# EAGLE design os32_master (EAGLE 9.3.0)
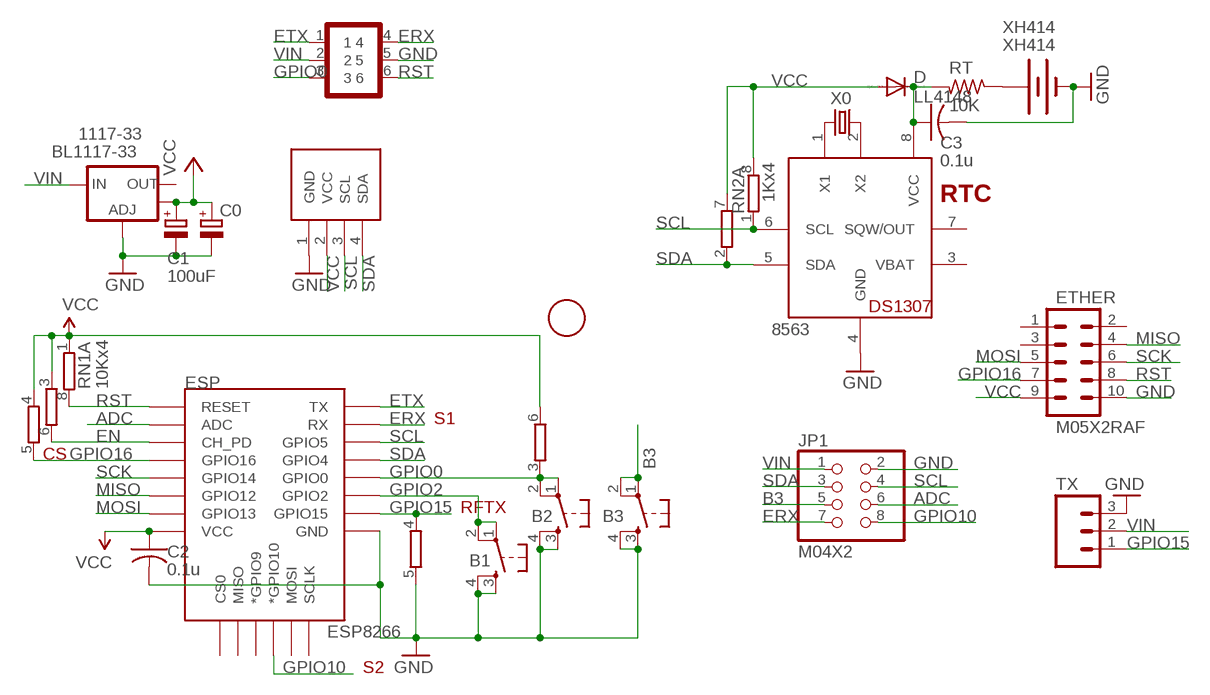
[diagram p0: schematic, sheet 1]

## Parts
1F  FIDUCIAL  [FIDUCIAL_1MM]
1117-33  BL1117-33  V_REG_LM1117SOT223  [SOT223]
8563  PCF8563  DS1307SOIC  [SO08]
B1  SPST_TACTEVQQ2  [EVQ-Q2]
B2  SPST_TACTEVQQ2  [EVQ-Q2]
B3  SPST_TACTEVQQ2  [EVQ-Q2]
C0  CPOL-EUE2.5-5  [E2,5-5]
C1  100uF  CPOL-EUCT3528  [CT3528]
C2  0.1u  C-USC0603  [C0603]
C3  0.1u  C-USC0603  [C0603]
D  LL4148  DIODE-MINIMELF  [MINIMELF]
ESP  ESP8266  ESP12ESMD  [ESP12E-SMD]
ETHER  M05X2RAF  [2X5-RAF]
JP1  M04X2  PINHD-2X4  [2X04]
LCD  SSD1306_OLED_I2CSMD3  [SSD1306_OLED_I2C_SMD3]
RN1  10Kx4  4R-NEXB38V  [EXB38V]
RN2  1Kx4  4R-NEXB38V  [EXB38V]
RT  10K  R-US_R0603  [R0603]
TX  M03LOCK  [1X03_LOCK]
U$3  GOLDFINGER_2X3  [GOLDFINGER_2X3]
X0  32.768kHz  CRYSTALMM20SS1  [MM20SS1]
XH414  XH414  BATTERYXH414  [BATTCON_XH414]

## Nets
ADC [adc]: ESP.ADC JP1.6
B3: B3.1 B3.2 JP1.5
EN: ESP.CH_PD RN1.6
ERX: ESP.RXD0(RX) JP1.7 U$3.4
ETX: ESP.TXD0(TX) U$3.1
GND: 1117-33.1(ADJ) 8563.4(GND) B1.3 B1.4 B2.3 B2.4 B3.3 B3.4 C0.- C1.+(-) C2.2 C3.2 ESP.GND ETHER.10 JP1.2 LCD.1(GND) RN2.5 TX.3 U$3.5 XH414.P$1(-)
GPIO0: B2.1 B2.2 ESP.GPIO0 RN2.3 U$3.3
GPIO2: B1.1 B1.2 ESP.GPIO2
GPIO10: ESP.GPIO10(*GPIO10) JP1.8
GPIO15: ESP.GPIO15 RN2.4 TX.1
GPIO16: ESP.GPIO16 ETHER.7 RN1.5
MISO: ESP.GPIO12 ETHER.4
MOSI: ESP.GPIO13 ETHER.5
N$1: 8563.1(X1) X0.1
N$11: 8563.8(VCC) C3.1 D.C RT.2
N$30: 8563.2(X2) X0.4
N$36: RT.1 XH414.P$2(+)
RST: ESP.RESET ETHER.8 RN1.8 U$3.6
SCK: ESP.GPIO14 ETHER.6
SCL [I2C]: 8563.6(SCL) ESP.GPIO5 JP1.4 LCD.3(SCL) RN2.1
SDA [I2C]: 8563.5(SDA) ESP.GPIO4 JP1.3 LCD.4(SDA) RN2.2
VCC [vcc]: 1117-33.4(OUT) C0.+ C1.-(+) C2.1 D.A ESP.VCC ETHER.9 LCD.2(VCC) RN1.1 RN1.3 RN1.4 RN2.6 RN2.7 RN2.8
VIN [power]: 1117-33.3(IN) JP1.1 TX.2 U$3.2
Unconnected: 1117-33.2(OUT) 8563.7(SQW/OUT) ESP.CS0 ESP.GPIO9(*GPIO9) ESP.MISO ESP.MOSI ESP.SCLK ETHER.1 ETHER.2 ETHER.3 RN1.2 RN1.7

## Notes on the sheet
- RTC
- S1
- CS
- RFTX
- S2

## Power pins joined to a net without a drawn wire
VBAT: 8563.3(VBAT)

## Library data of the parts
1F = adafruitGood:FIDUCIAL: For use by pick and place machines to calibrate the vision/machine, 1mm By microbuilder.eu
1117-33 = SparkFun:V_REG_LM1117: Voltage Regulator LM1117 Standard adjustable voltage regulator but in SMD form. Spark Fun Electronics SKU : COM-00595
8563 = adafruit:DS1307: DS1307 Real time clock (RTC) with battery backup ability. Talk to it via i2c
B1-B3 = adafruit_3:SPST_TACT: SMT 6mm switch, EVQQ2 series http://www.ladyada.net/library/eagle
C0 = rcl:CPOL-EU: POLARIZED CAPACITOR, European symbol
C1 = resistor:CPOL-EU: POLARIZED CAPACITOR, European symbol
C2 C3 = adafruit:C-US: CAPACITOR, American symbol
D = diode:DIODE-: DIODE
ESP = esp8266modules:ESP12E: ESP12E Module
ETHER = SparkFunNew:M05X2: Header 5x2 Standard 10-pin dual row 0.1" header. Commonly used with AVR-ISP. Use with Spark Fun Electronics SKU: PRT-00778
JP1 = pinhead:PINHD-2X4: PIN HEADER
LCD = adafruit2013:SSD1306_OLED_I2C
RN1 RN2 = resistor-dil:4R-N: Array Chip Resistor Source: RS Component / Phycomp; OC_FARNELL: unknown; OC_NEWARK: unknown
RT = adafruitGood:R-US_: RESISTOR, American symbol
TX = SparkFun:M03: Header 3 Standard 3-pin 0.1" header. Use with straight break away headers (SKU : PRT-00116), right angle break away headers (PRT-00553), swiss pins (PRT-00743), machine pins (PRT-00117), and female headers (PRT-00115). Molex polarized connector foot print use with SKU : PRT-08232 with associated crimp pins and housings.
U$3 = SparkFunNew:GOLDFINGER_2X3
X0 = crystal:CRYSTAL: CRYSTAL
XH414 = SparkFunNew:BATTERY: Battery Holders Various common sizes : AA, AAA, 20mm coin cell and 12mm coin cell.

## Net classes
0 default: width 0.254 mm, clearance 0.203 mm
1 power: width 0.406 mm, clearance 0.203 mm
2 relaypower: width 0.254 mm, clearance 0.203 mm
3 signal: width 0.254 mm, clearance 0.203 mm
4 adc: width 0.406 mm, clearance 0.203 mm
5 vcc: width 0.305 mm, clearance 0.203 mm
6 I2C: width 0.254 mm, clearance 0.203 mm

## Board
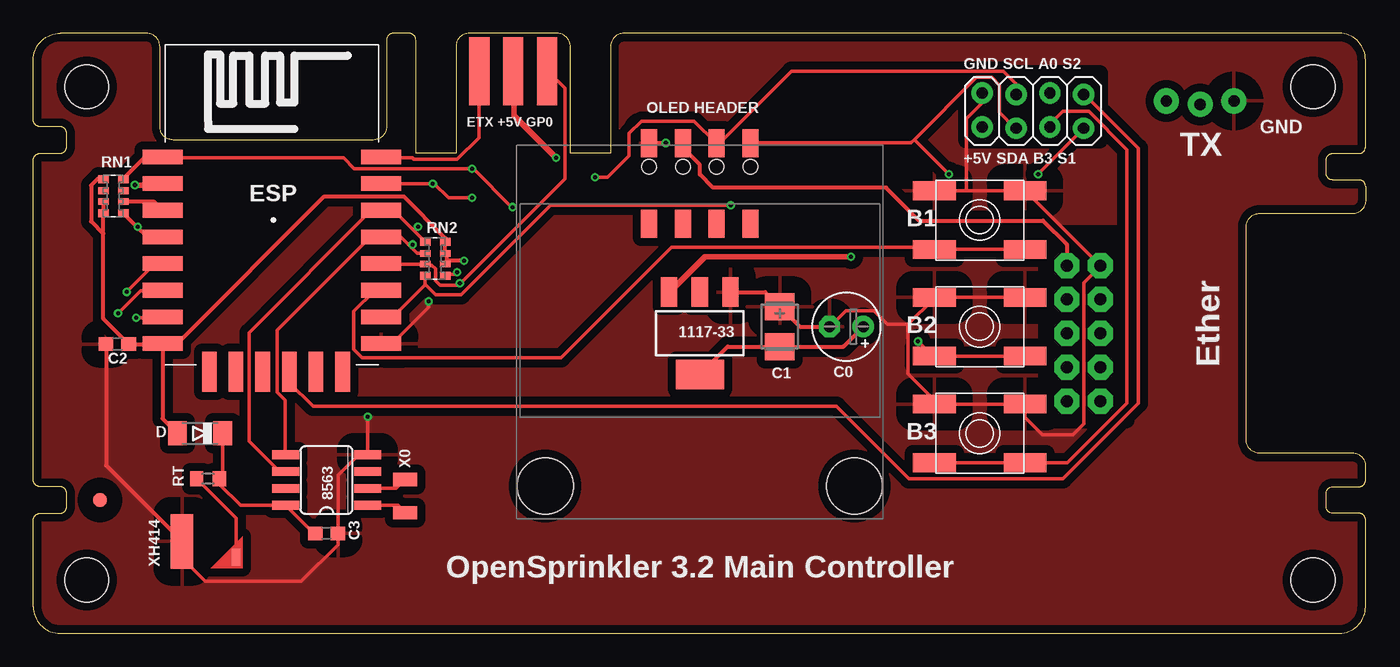
[diagram p1: board, top side]
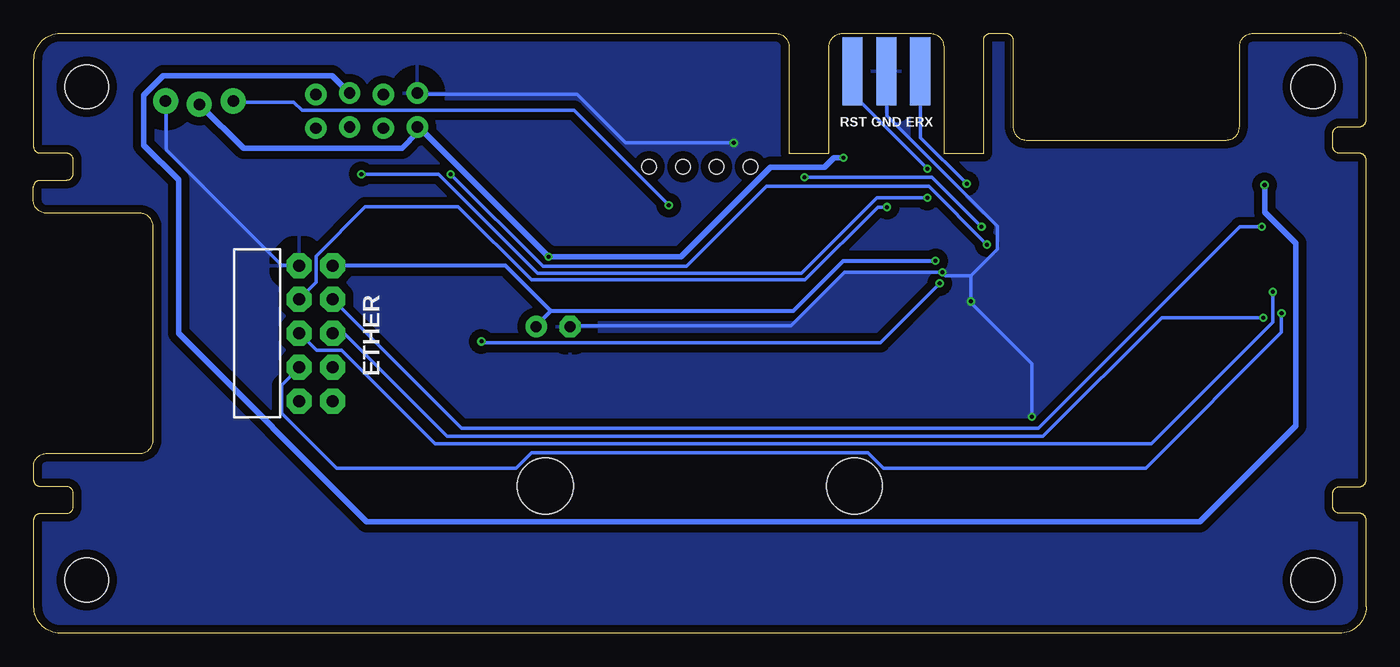
[diagram p2: board, bottom side, seen from below]

Size 100 x 45 mm. Coordinates in mm from the lower left corner, seen from the top.
Outline: 2,0 98,0 arc90 99.95,2 99.95,8.5 arc90 99.5,9 97.5,9 arc-90 97,9.5 97,10.5 arc-90 97.5,11 99.5,11 arc90 99.95,11.5 99.99,12.49 arc91 98.99,13.5 92,13.5 arc-90 91,14.5 91,30.5 arc-90 92,31.5 99,31.5 arc90 100,32.5 100,33.5 99.95,33.5 arc90 99.5,34 97.5,34 arc-90 97,34.5 97,35.5 arc-90 97.5,36 99.5,36 arc90 99.95,36.5 99.95,43 arc90 98,45 44.3,45 arc90 43.3,44 43.3,36 40.3,36 40.3,44 arc90 39.3,45 32.7,45 arc90 31.7,44 31.7,36 28.7,36 28.7,44.5 arc90 28.2,45 27,45 arc90 26.5,44.5 26.5,38 arc-90 25.5,37 10.5,37 arc-90 9.5,38 9.5,44 arc90 8.5,45 2,45 arc90 0,43 0,38.5 arc90 0.5,38 2,38 arc-90 2.5,37.5 2.5,36.5 arc-90 2,36 0.5,36 arc90 0,35.5 0,11.5 arc90 0.5,11 2,11 arc-90 2.5,10.5 2.5,9.5 arc-90 2,9 0.5,9 arc90 0,8.5 0,2 arc90 2,0
Copper layers (1*16): Top 0.035mm / dielectric 1.5mm / Bottom 0.035mm
Design rules "Fusion_eagle_rule_v1.1 *": minimum track width 6mil, minimum drill 12mil, track to track 6mil, track to pad 6mil, pad to pad 6mil, via to via 6mil, smd to smd 0mil, copper to edge 10mil, drill to drill 10mil, minimum pad ring 10mil, minimum via ring 6mil, stop-mask expansion 2mil, vias tented up to drill 100mil, thermal gap 50mil
Holes 3.3 mm at 4,4 96,4 4,41 96,41
tRestrict: area 12.5,6 to 13.5,8; area 70,37 to 80,42; area 76,16 to 82,30; area 13,6 to 15,9.5
vRestrict: area 11,20.5 to 25,36.5; area 31.5,36 to 40.5,45

### Footprints (pad centres in the part's own frame; a part is rotated, then mirrored left to right if it is on the bottom)
FIDUCIAL_1MM = smd 1 x 1: 1 0,0
SOT223 = smd 1.219 x 2.235: 1 -2.311,-3.099; 2 0,-3.099; 3 2.311,-3.099 | smd 3.6 x 2.2: 4 0,3.099
SO08 = smd 0.66 x 2.032: 1 -1.905,-3.073; 2 -0.635,-3.073; 3 0.635,-3.073; 4 1.905,-3.073; 5 1.905,3.073; 6 0.635,3.073; 7 -0.635,3.073; 8 -1.905,3.073
EVQ-Q2 = smd 3.2 x 1.4: 1 -3.4,-2.2; 2 3.4,-2.2; 3 -3.4,2.2; 4 3.4,2.2
E2,5-5 = drill 0.813 pad 1.6: + -1.27,0 | drill 0.813 pad 1.6 octagon: - 1.27,0
CT3528 = smd 2 x 2.2: + -1.5,0; - 1.5,0
C0603 = smd 1.1 x 1: 1 -0.85,0; 2 0.85,0
MINIMELF = smd 1.4 x 1.8: A 1.7,0; C -1.7,0
ESP12E-SMD = smd 3 x 1.1: ADC -8.3,2.73; CH_PD -8.3,0.73; GND 8.1,-9.27; GPIO0 8.1,-3.27; GPIO2 8.1,-5.27; GPIO4 8.1,-1.27; GPIO5 8.1,0.73; GPIO12 -8.3,-5.27; GPIO13 -8.3,-7.27; GPIO14 -8.3,-3.27; GPIO15 8.1,-7.27; GPIO16 -8.3,-1.27; RESET -8.3,4.73; RXD0 8.1,2.73; TXD0 8.1,4.73; VCC -8.3,-9.27 | smd 1.1 x 3: CS0 -4.8,-11.37; GPIO9 -0.8,-11.37; GPIO10 1.2,-11.37; MISO -2.8,-11.37; MOSI 3.2,-11.37; SCLK 5.2,-11.37
2X5-RAF = drill 0.9 pad 1.88 octagon: 1 -1.27,5.08; 2 1.27,5.08; 3 -1.27,2.54; 4 1.27,2.54; 5 -1.27,0; 6 1.27,0; 7 -1.27,-2.54; 8 1.27,-2.54; 9 -1.27,-5.08; 10 1.27,-5.08
2X04 = drill 0.85 pad 1.6: 1 -3.81,-1.219; 2 -3.81,1.321; 3 -1.27,-1.321; 4 -1.27,1.219; 5 1.27,-1.219; 6 1.27,1.321; 7 3.81,-1.321; 8 3.81,1.219
SSD1306_OLED_I2C_SMD3 = smd 1.2 x 2.1: 1 -3.81,1.75; 1' -3.81,-4.29; 2 -1.27,1.75; 2' -1.27,-4.29; 3 1.27,1.75; 3' 1.27,-4.29; 4 3.81,1.75; 4' 3.81,-4.29 | hole 4.2: 11.6,-23.95; -11.6,-23.95 | hole 1.1: -3.81,-0.01; -1.27,-0.01; 1.27,-0.01; 3.81,-0.01
EXB38V = smd 0.6 x 0.8: 1 -1.275,-0.75; 4 1.275,-0.75; 5 1.275,0.75; 8 -1.275,0.75 | smd 0.5 x 0.8: 2 -0.4,-0.75; 3 0.4,-0.75; 6 0.4,0.75; 7 -0.4,0.75
R0603 = smd 1 x 1.1: 1 -0.85,0; 2 0.85,0
1X03_LOCK = drill 0.85 pad 1.88: 1 0,0.127; 2 2.54,-0.127; 3 5.08,0.127
GOLDFINGER_2X3 = smd 1.524 x 5.08: 1 -2.54,-2.54; 2 0,-2.54; 3 2.54,-2.54 | smd 1.524 x 5.08 bottom: 4 -2.54,-2.54; 5 0,-2.54; 6 2.54,-2.54
MM20SS1 = smd 1.8 x 1: 1 0,-1.25; 4 0,1.25
BATTCON_XH414 = smd 4.1 x 1.7: P$1 0.7,-1.85 | smd 1.27 x 0.635: P$2 1.9,2.2

### Placement (x,y rotation side)
1F  5,10 0 top
1117-33  50,22.5 180 top
8563  22,11.5 90 top
B1  71,31 0 top
B2  71,23 0 top
B3  71,15 0 top
C0  61,23 180 top
C1  56,23 270 top
C2  6.3,21.7 180 top
C3  22,7.5 0 top
D  12.5,15 180 top
ESP  18,31 0 top
ETHER  78.8,22.5 180 bottom
JP1  75,39.2 0 top
LCD  50,35 0 top
RN1  6,32.8 270 top
RN2  30.15,28.1 270 top
RT  13.1,11.6 0 top
TX  85,39.8 0 top
U$3  36,44.7 0 top
X0  27.9,10.3 0 top
XH414  13,7.6 270 top

### Tracks (layer width: path | path; a pad name or v marks a point on that pad's centre or on a via)
ADC  (via drill 0.3)
  Top 0.406: v7.62,33.62 9.62,33.62 ESP.ADC
  Bottom 0.406: v7.62,33.62 7.62,31.6 5.3,29.27 5.3,15.57 12.5,8.38 74.98,8.38 89.1,22.49 89.1,34.02 91.7,36.62 91.7,40.38 90.25,41.83 77.58,41.83 76.38,40.62 JP1.6
B3
  Top 0.254: B3.1 B3.2 77.59,12.8 82.03,17.24 82.03,36.29 79.18,39.14 77.23,39.14 76.27,38.18 JP1.5
EN
  Top 0.305: RN1.6 9.03,32.4 ESP.CH_PD
ERX  (via drill 0.3)
  Top 0.254: ESP.RXD0 26.11,33.73 v29.97,33.73 30.07,33.73 31.15,32.66 v32.93,32.66 | v75.39,34.44 78.74,37.8 JP1.7
  Bottom 0.254: v29.97,33.73 33.43,37.19 33.43,42.06 U$3.4 | v75.39,34.44 69.6,34.44 62.17,27.02 42.38,27.02 36.71,32.68 32.95,32.68 v32.93,32.66
ETX
  Top 0.254: ESP.TXD0 26.11,35.66 28.45,35.66 28.55,35.56 31.8,35.56 33.43,37.19 33.43,42.06 U$3.1
GND  (via drill 0.3)
  Top 0.254: B1.3 70,33.2 | 70,33.2 B1.4 74.62,33 80,27.62 ETHER.10 78.8,26.31 78.8,15.73 77.98,14.91 75.7,14.91 74.4,16.21 B3.4 B3.3 67.56,17.27 67.56,17.53 65.63,19.46 65.63,23.16 | B2.4 B2.3 67.56,25.09 65.63,23.16 | XH414.P$1 11.15,5.65 12.9,3.9 20.1,3.9 22.85,6.65 C3.2 22.85,11.85 24.45,13.45 24.5,13.4 8563.4 25.09,13.51 v25.09,16.26 | v31.8,27.09 31.64,26.92 30.99,26.92 RN2.5 | v29.67,24.89 29.67,24.45 26.96,21.74 26.11,21.74 ESP.GND | v47.45,36.78 46.23,36.78 LCD.1 | 65.63,23.16 64.09,23.16 63.08,24.18 60.96,24.18 59.84,23.06 C0.- | 70,33.2 70,38.61 71.12,39.72 71.12,40.44 JP1.2
  Top 0.305: C2.2 5.45,12.6 XH414.P$1 | C0.- 57.5,23 C1.+ 54.9,25.6 1117-33.1
  Bottom 0.254: 29.67,26.83 27.67,28.82 27.67,30.51 35.97,38.81 35.97,42.06 U$3.5 | 29.67,26.83 29.7,26.8 29.7,26.84 31.55,26.84 v31.8,27.09 39.14,27.09 43.16,23.06 59.64,23.06 C0.- | 29.67,26.83 v29.67,24.89 29.67,24.79 25.09,20.22 v25.09,16.26 | v47.45,36.78 55.56,36.78 59.22,40.44 71.12,40.44 JP1.2 | TX.3 90.02,39.83 90.02,36.37 90,36.25 81.38,27.62 80.12,27.62 ETHER.10
  pour Top (isolate 0.61): 0,45 100,45 100,0 0,0
  pour Bottom (isolate 0.61): 0,45 100,45 100,0 0,0
GPIO0  (via drill 0.3)
  Top 0.254: ESP.GPIO0 26.13,27.7 RN2.3 29.5,27.62 29.87,27.62 30.16,27.33 30.16,26.46 30.5,26.12 32,26.12 | B2.2 B2.1 67.1,21.18 v66.39,21.89 | 32,26.12 32.12,26.12 32.12,26.34 39.88,34.09 39.88,40.88 38.62,42.12 U$3.3 | v32,26.25 32,26.12
  Bottom 0.254: v66.39,21.89 66.29,21.8 36.45,21.8 v32,26.25
GPIO2
  Top 0.254: B1.2 B1.1 67.44,28.96 47.89,28.96 39.6,20.68 24.67,20.68 24.04,21.3 24.04,24.14 25.6,25.7 26.01,25.7 ESP.GPIO2
GPIO10
  Top 0.254: JP1.8 78.86,40.42 82.91,36.37 82.91,17.27 77.23,11.6 65.68,11.6 60.25,17.03 20.98,17.03 19.2,18.8 19.2,19.61 ESP.GPIO10
GPIO15  (via drill 0.3)
  Top 0.254: ESP.GPIO15 26.98,23.73 29.4,26.15 | 29.4,26.15 RN2.4 | v52.32,32.11 38.8,32.11 32.11,25.41 30.17,25.41 29.46,26.11 29.4,26.15
  Bottom 0.254: v52.32,32.11 59.43,39.22 79.84,39.22 80.46,39.83 84.94,39.83 TX.1
GPIO16  (via drill 0.3)
  Top 0.254: v7.82,30.48 7.81,30.47
  Top 0.305: ESP.GPIO16 8.54,29.73 7.81,30.47 RN1.5
  Bottom 0.254: v7.82,30.48 9.49,30.48 24.59,15.39 67.88,15.39 ETHER.7
MISO  (via drill 0.3)
  Top 0.254: v6.35,24.02 8.04,25.7 9.65,25.7 ESP.GPIO12
  Bottom 0.254: ETHER.4 80.12,19.88 81.38,18.62 81.38,16.5 77.25,12.38 63.78,12.38 62.63,13.53 37.37,13.53 36.22,12.38 16.55,12.38 6.35,22.57 v6.35,24.02
MOSI  (via drill 0.3)
  Top 0.254: v7.72,23.67 9.65,23.67 ESP.GPIO13
  Bottom 0.254: v7.72,23.67 15.34,23.67 24.24,14.78 68.97,14.78 76.7,22.5 ETHER.5
N$1
  Top 0.254: 8563.1 27.36,9.6 X0.1
N$11
  Top 0.254: C3.1 21.02,7.5 8563.8 15.55,9.6 13.95,11.2 RT.2 14.2,11.85 D.C
N$30
  Top 0.254: 8563.2 27.21,10.87 X0.4
N$36
  Top 0.254: RT.1 15.2,8.65 XH414.P$2
RST  (via drill 0.3)
  Top 0.254: ESP.RESET 9.75,35.66 23.26,35.66 24.08,34.85 v32.92,34.85 33.02,34.85 35.9,31.97 v35.95,31.97
  Top 0.305: ESP.RESET 8.4,35.73 RN1.8
  Bottom 0.254: v32.92,34.85 38.51,40.43 38.51,42.06 U$3.6 | v35.95,31.97 36.64,31.97 42.11,26.5 62.61,26.5 68.11,32 75.09,32 78.8,28.3 78.8,26.32 80,25.12 ETHER.8
SCK  (via drill 0.3)
  Top 0.254: v7.01,25.6 9.04,27.64 9.65,27.64 ESP.GPIO14
  Bottom 0.254: v7.01,25.6 7.01,23.32 16.11,14.22 24.33,14.22 24.49,14.22 24.65,14.21 24.66,14.22 69.84,14.22 76.86,21.23 78.73,21.23 80,22.5 ETHER.6
SCL  (via drill 0.3)
  Top 0.254: RN2.1 28.57,30.2 | 28.57,30.2 27.07,31.7 26.13,31.7 ESP.GPIO5 26.01,31.7 25.32,31.7 16.18,22.55 16.18,14.4 18.39,12.19 18.9,12.19 8563.6 | JP1.4 73.73,41.21 72.77,42.16 56.9,42.16 51.52,36.78 51.31,36.78 LCD.3 51.21,36.78 49.59,38.4 45.62,38.4 44.71,37.49 44.71,35.83 43.08,34.2 v42.13,34.2 | v28.85,30.48 28.57,30.2
  Bottom 0.254: v28.85,30.48 32.57,34.2 v42.13,34.2
SDA  (via drill 0.3)
  Top 0.254: RN2.2 28.8,28.5 28.29,29.01 | 28.29,29.01 27.57,29.73 ESP.GPIO4 26.01,29.67 25.21,29.67 18.29,22.74 18.29,18.09 18.9,17.48 18.9,13.41 8563.5 | 66.09,37.03 70.75,41.7 71.91,41.7 72.48,41.12 72.48,39.07 73.66,37.9 JP1.3 | 66.09,37.03 65.84,36.78 53.85,36.78 LCD.4 | v28.45,29.16 28.29,29.01 | 66.09,37.03 v68.68,34.44
  Bottom 0.254: v28.45,29.16 32.82,33.53 45.01,33.53 51,27.53 61.77,27.53 v68.68,34.44
VCC  (via drill 0.3)
  Top 0.305: ESP.VCC 9.7,16.1 D.A | ESP.VCC 9.67,21.7 C2.1 5.25,23.6 5.25,29.97 | RN1.3 RN1.4 5.25,29.97 | 1117-33.4 52.1,21.5 C1.- 60.77,21.5 C0.+ | ESP.VCC 9.75,21.84 10.9,21.84 21.83,32.77 27.77,32.77 30.9,29.65 RN2.8 30.89,29.36 30.89,28.65 RN2.7 30.99,28.45 30.99,27.74 RN2.6 31.14,27.93 v32.31,27.93 | LCD.2 48.77,36.68 48.77,36.37 50.01,35.13 50.01,34.42 51.01,33.43 63.98,33.43 66.44,30.96 75.75,30.96 77.53,29.18 ETHER.9 | RN1.1 4.82,34.08 4.33,33.59 4.33,30.89 5.25,29.97
  Bottom 0.305: v32.31,27.93 39.23,27.93 42.99,24.18 61.16,24.18 | 61.16,24.18 62.18,23.16 C0.+ | 61.16,24.18 61.25,24.25 64.58,27.58 ETHER.9
VIN  (via drill 0.3)
  Top 0.406: v61.35,28.24 50.39,28.24 47.75,25.6 1117-33.3 | v39.22,35.66 36.07,38.81 36.07,42.06 U$3.2
  Bottom 0.406: TX.2 87.48,39.62 87.46,39.62 84.22,36.38 72.34,36.38 71.19,37.53 JP1.1 71.08,37.98 v61.35,28.24 61.31,28.24 61.3,28.25 51.41,28.25 44.7,34.95 40.64,34.95 39.93,35.66 v39.22,35.66

### Text on the board
tNames: GND SCL A0 S2 | OLED HEADER | ETX +5V GP0 | GND | +5V SDA B3 S1 | Ether | XH414 | OpenSprinkler 3.2 Main Controller
bNames: RST GND ERX